# Altium project 8bit_RAM.PrjPcb
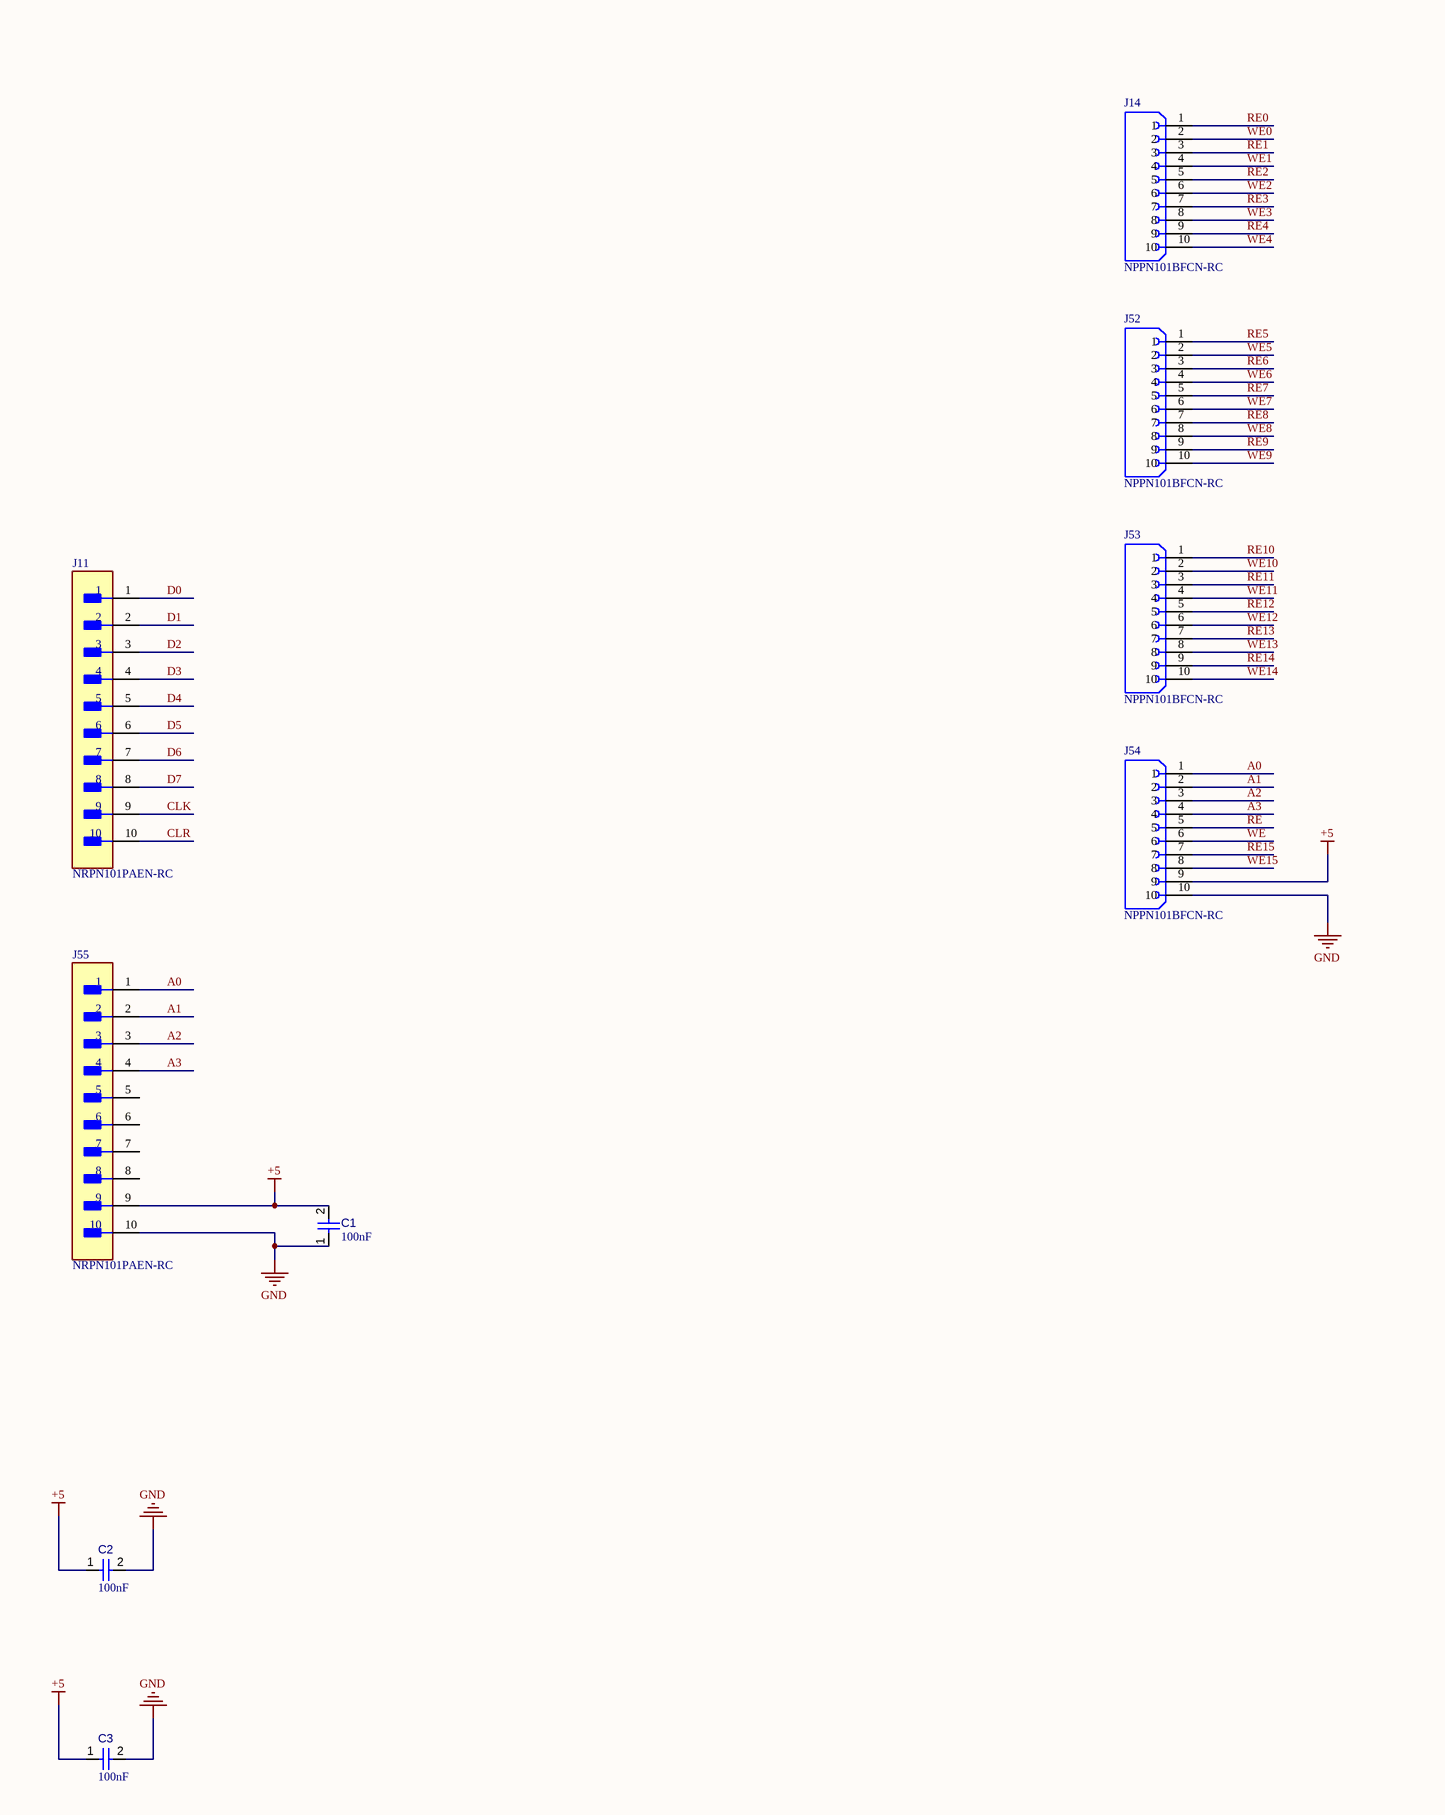
[diagram p0: 8bit_RAM.SchDoc, top left]
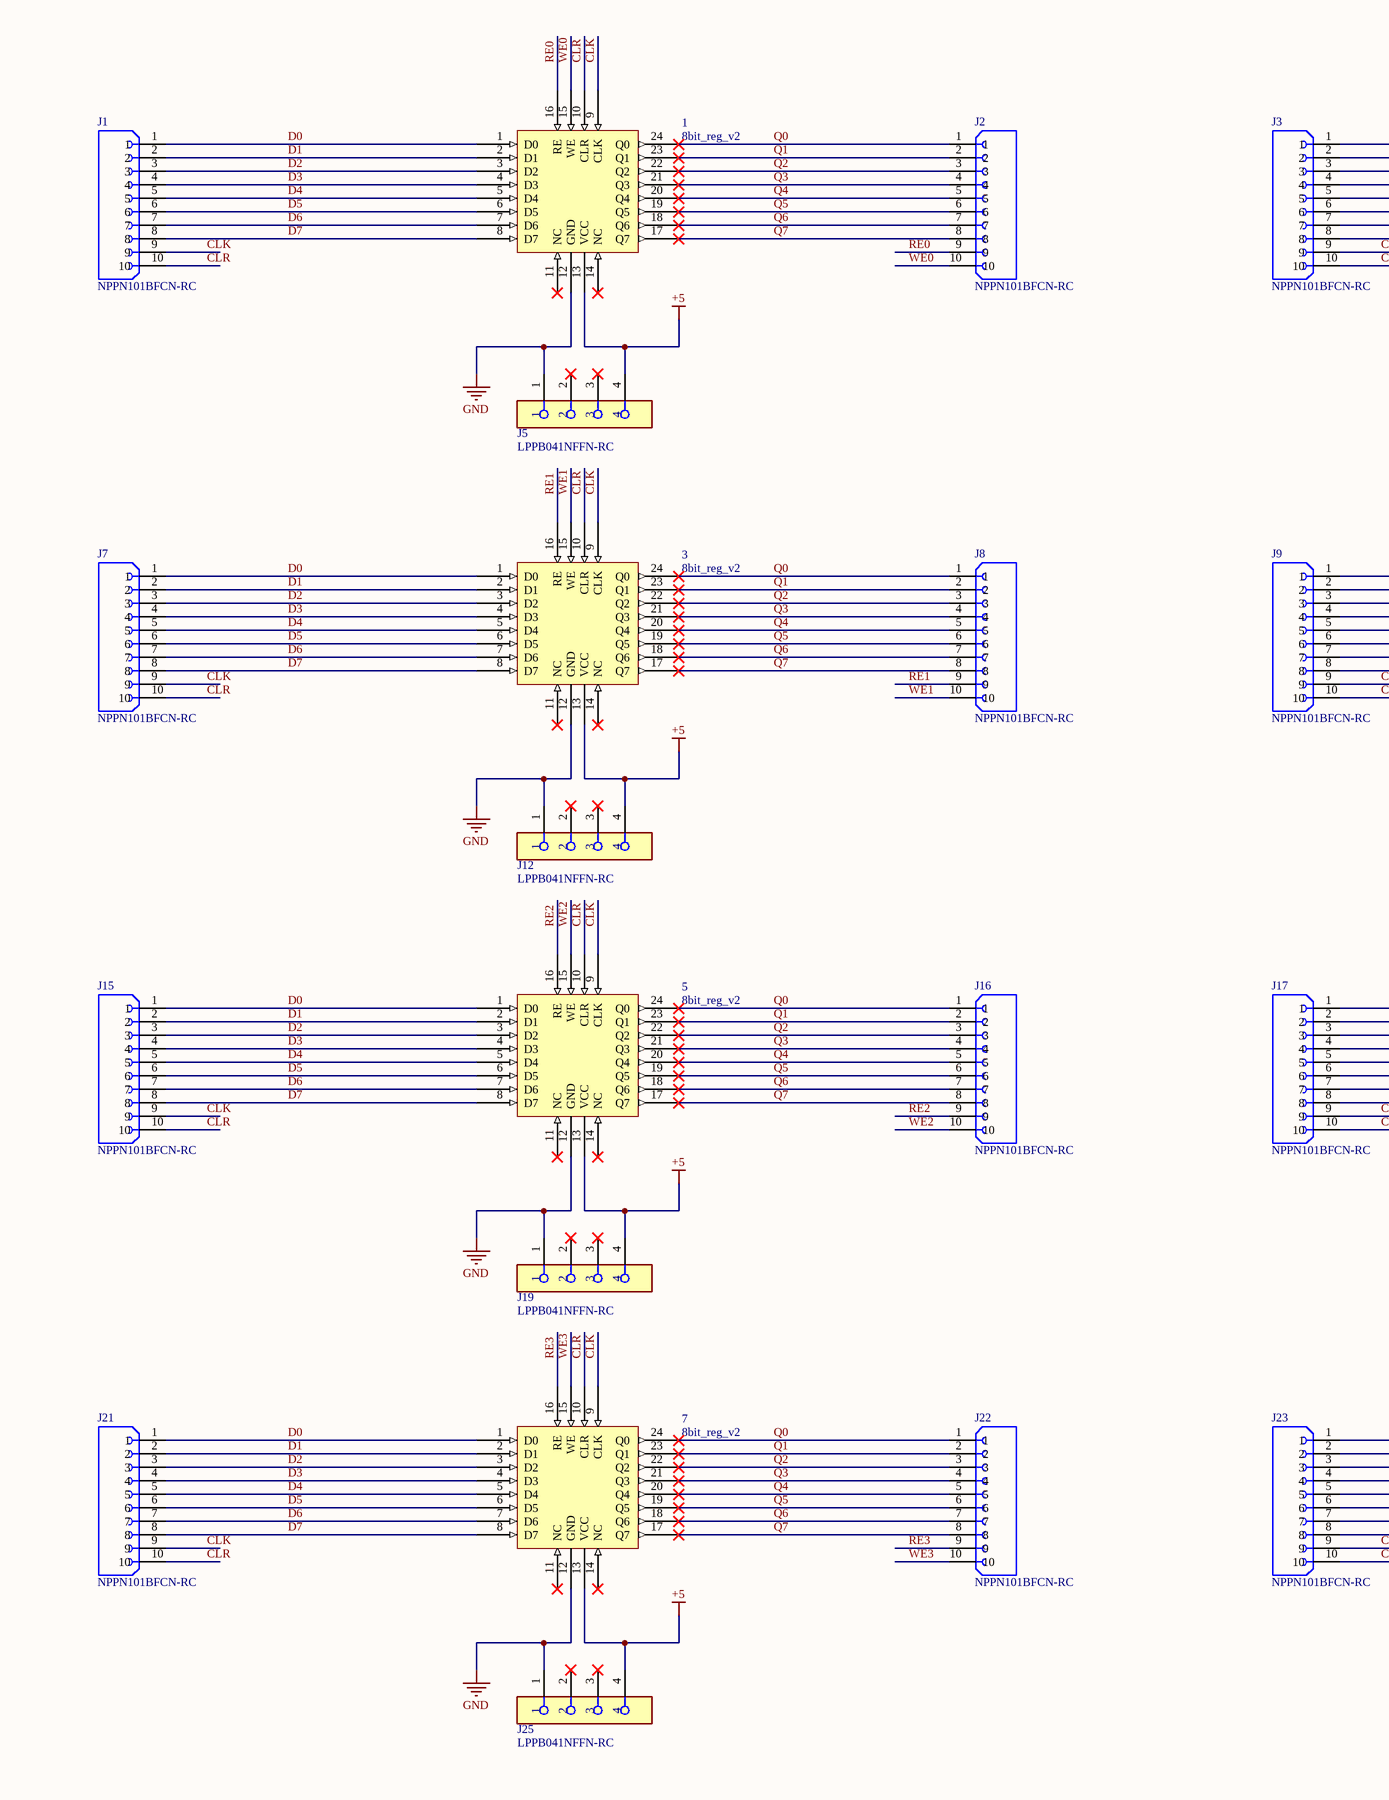
[diagram p1: 8bit_RAM.SchDoc, top middle]
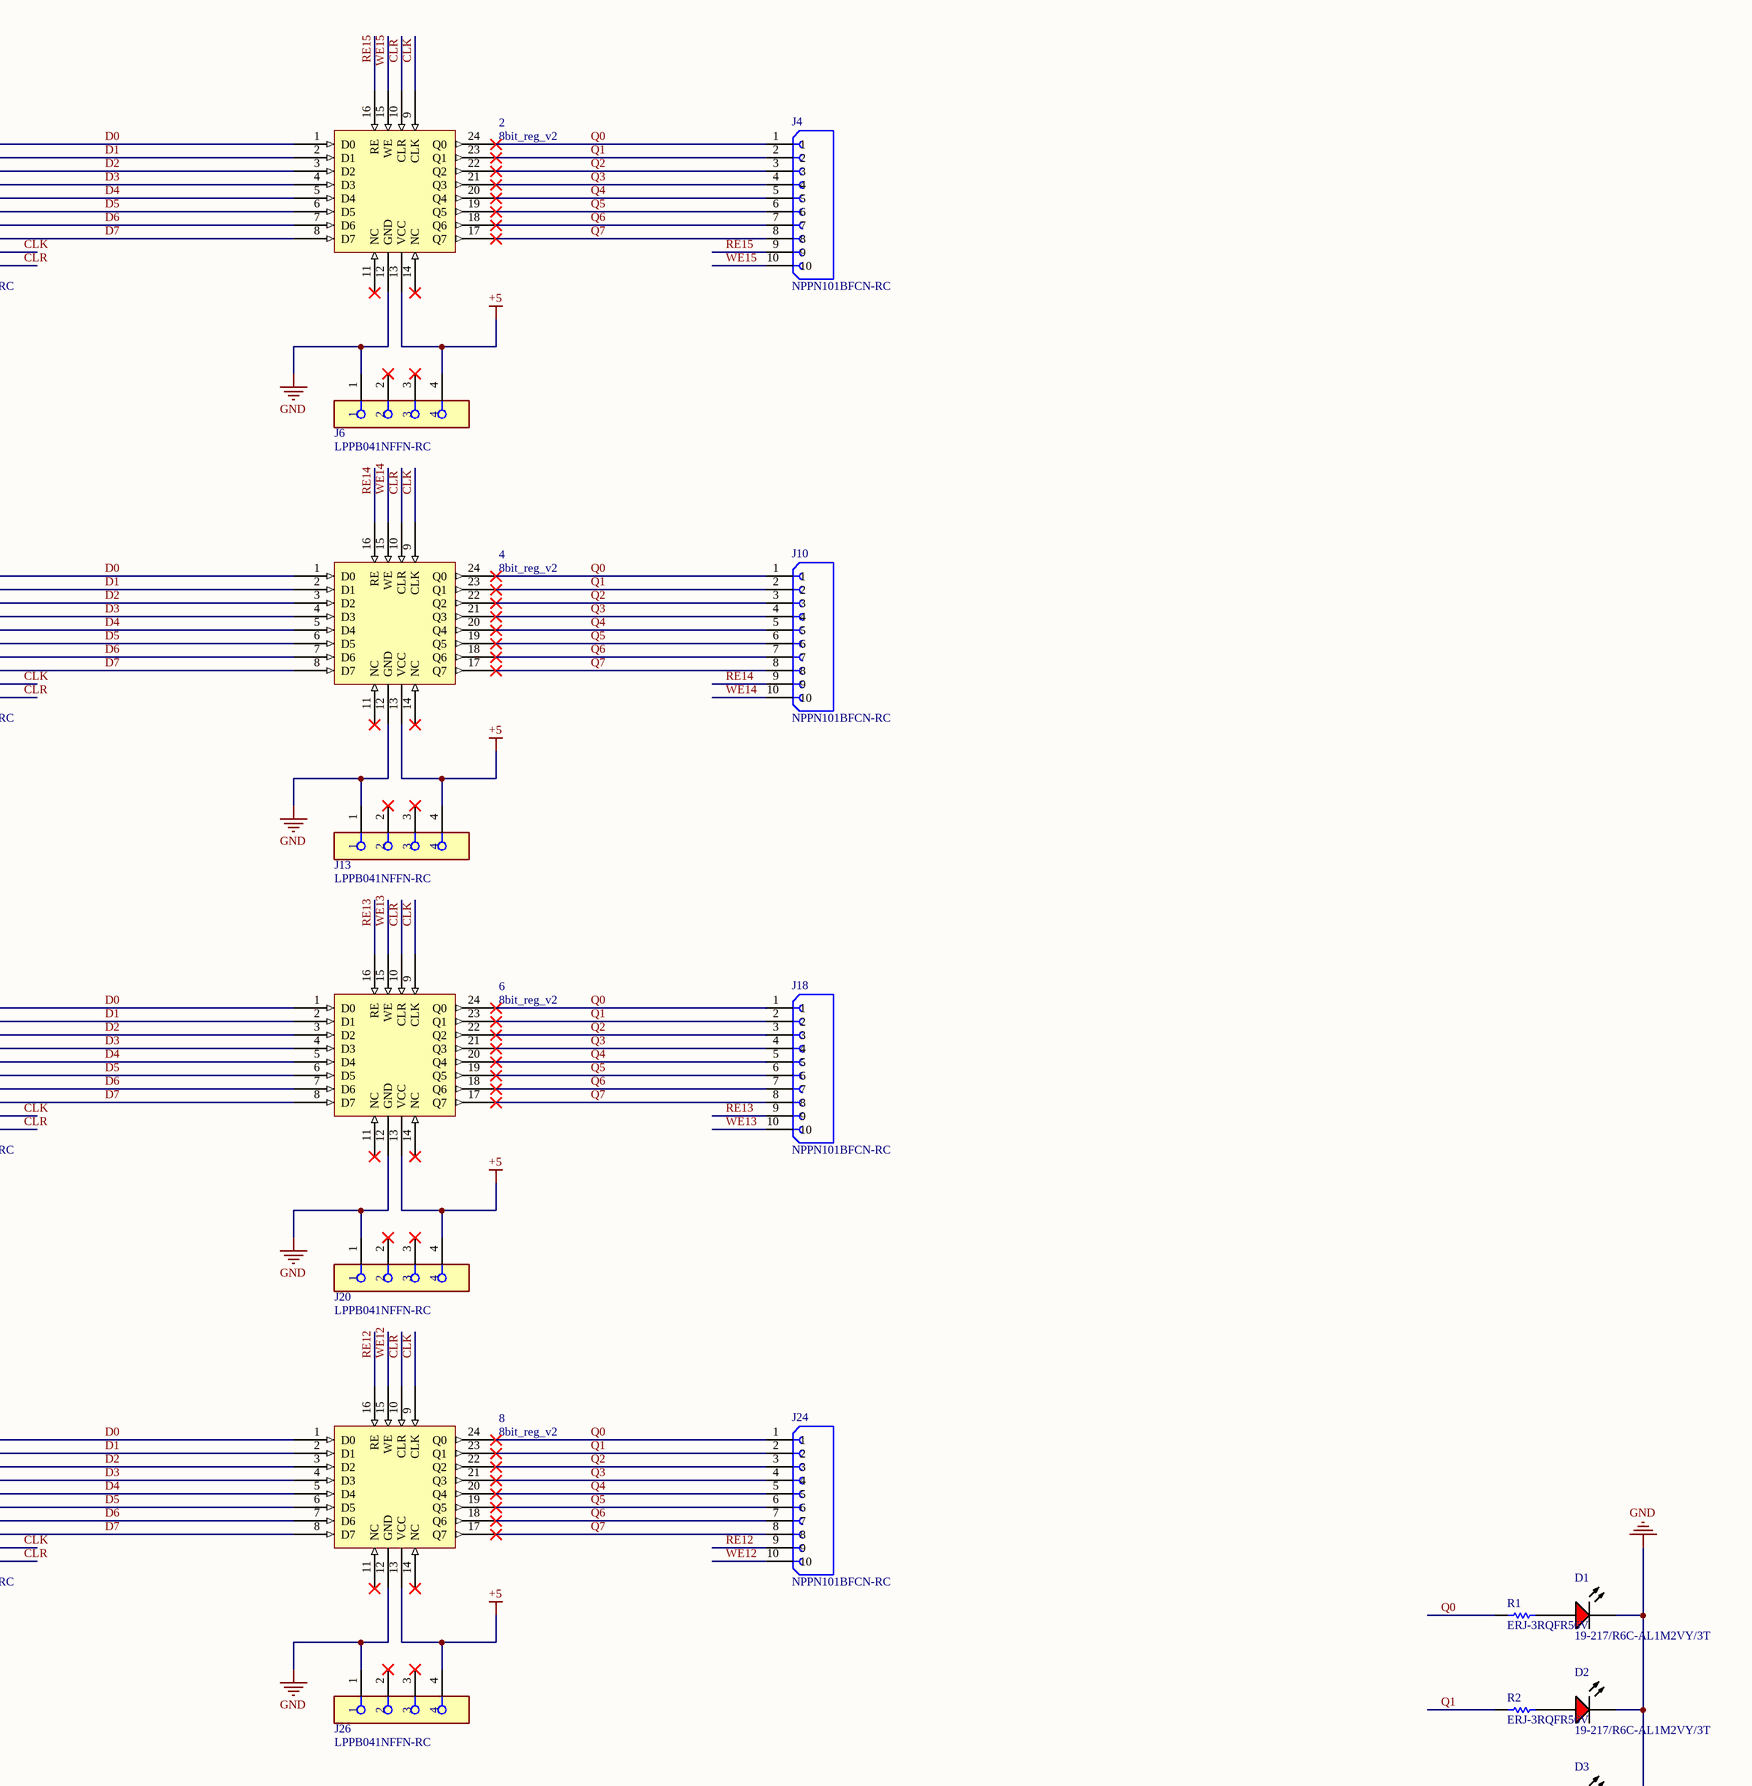
[diagram p2: 8bit_RAM.SchDoc, top right]
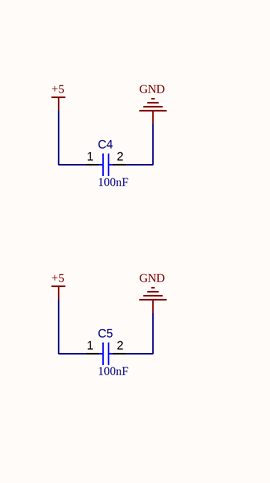
[diagram p3: 8bit_RAM.SchDoc, bottom left]
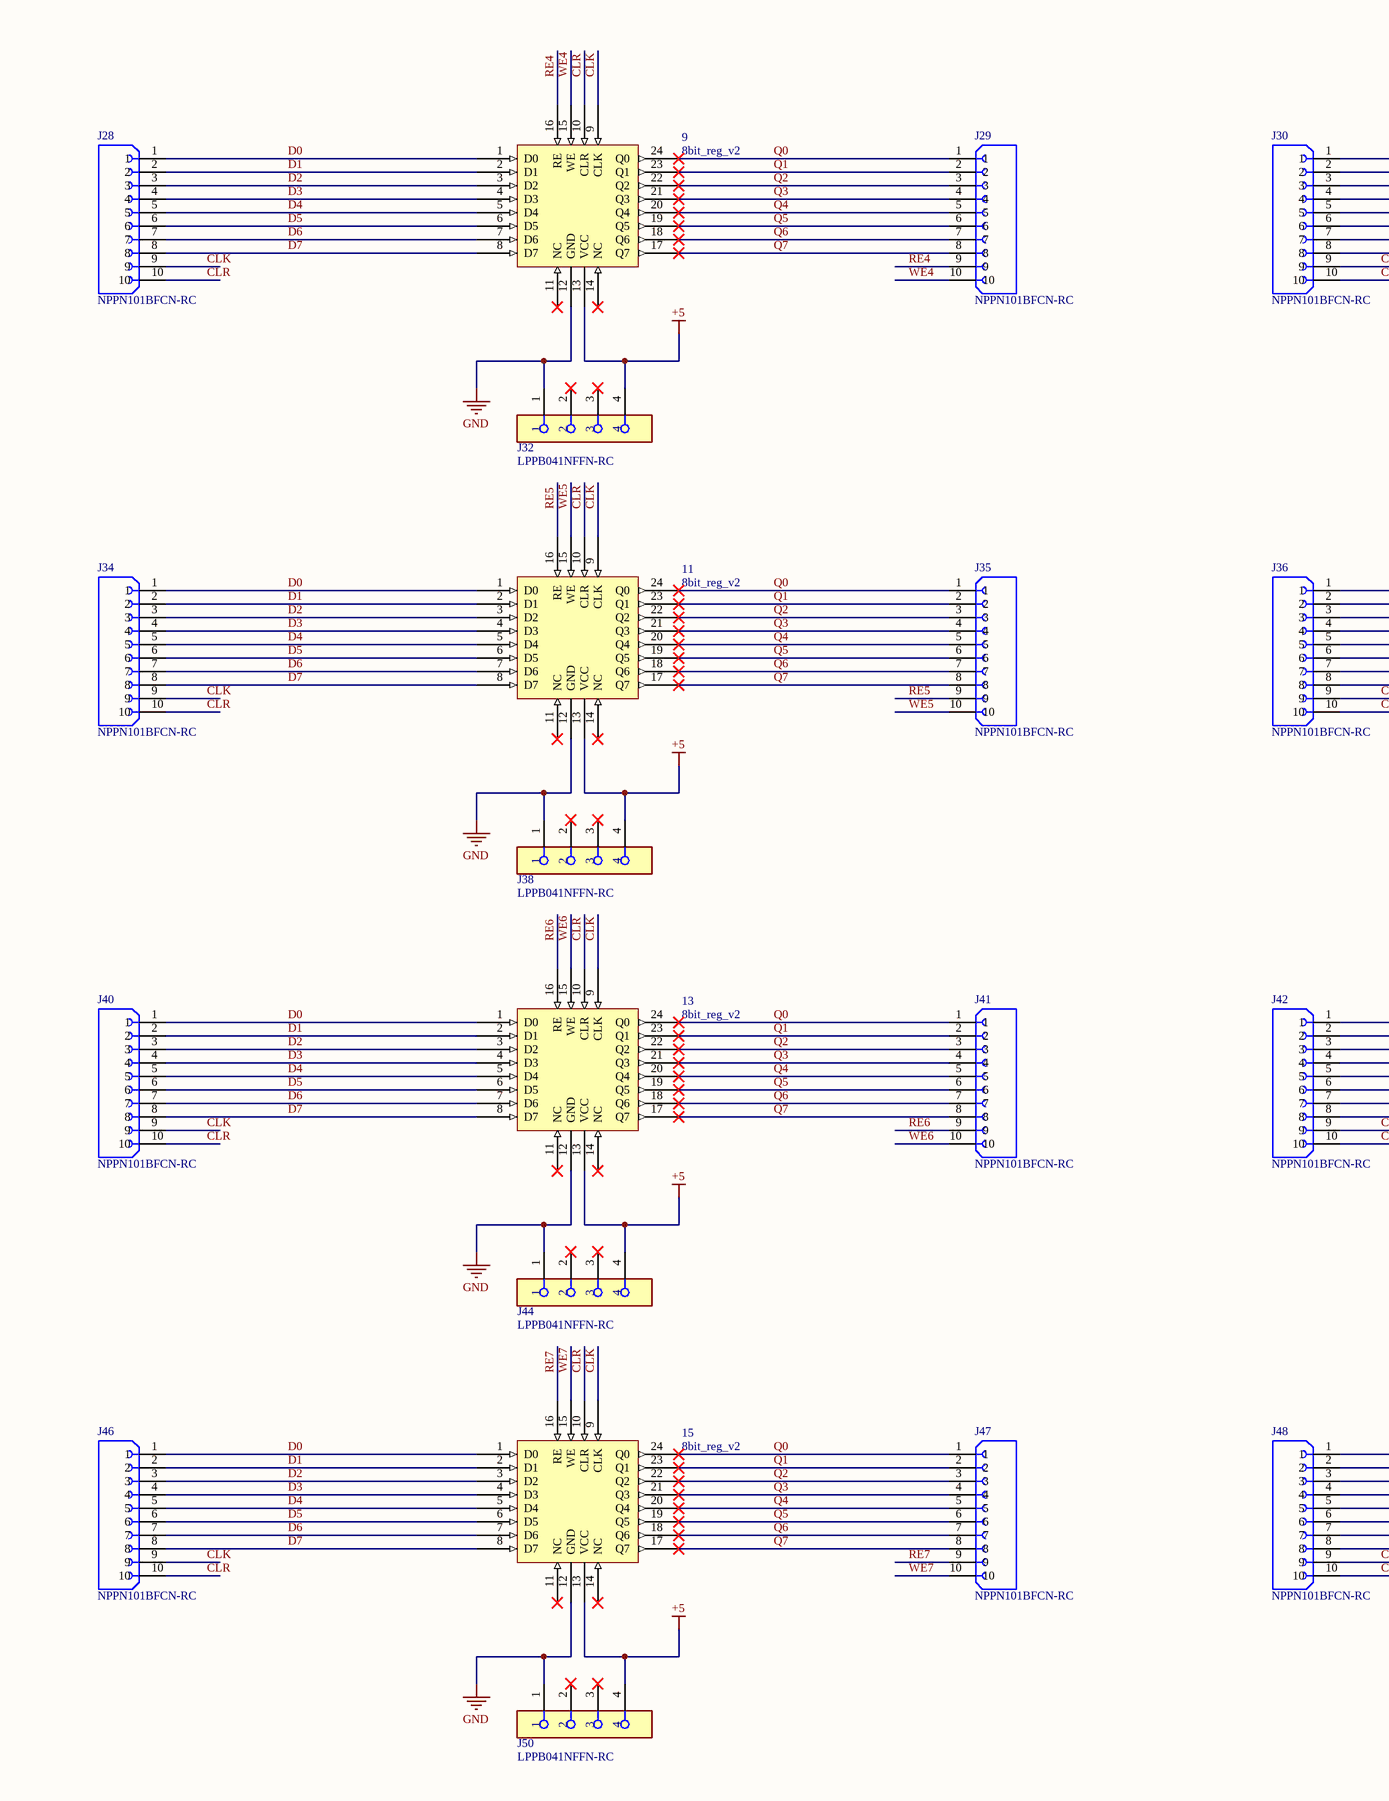
[diagram p4: 8bit_RAM.SchDoc, bottom middle]
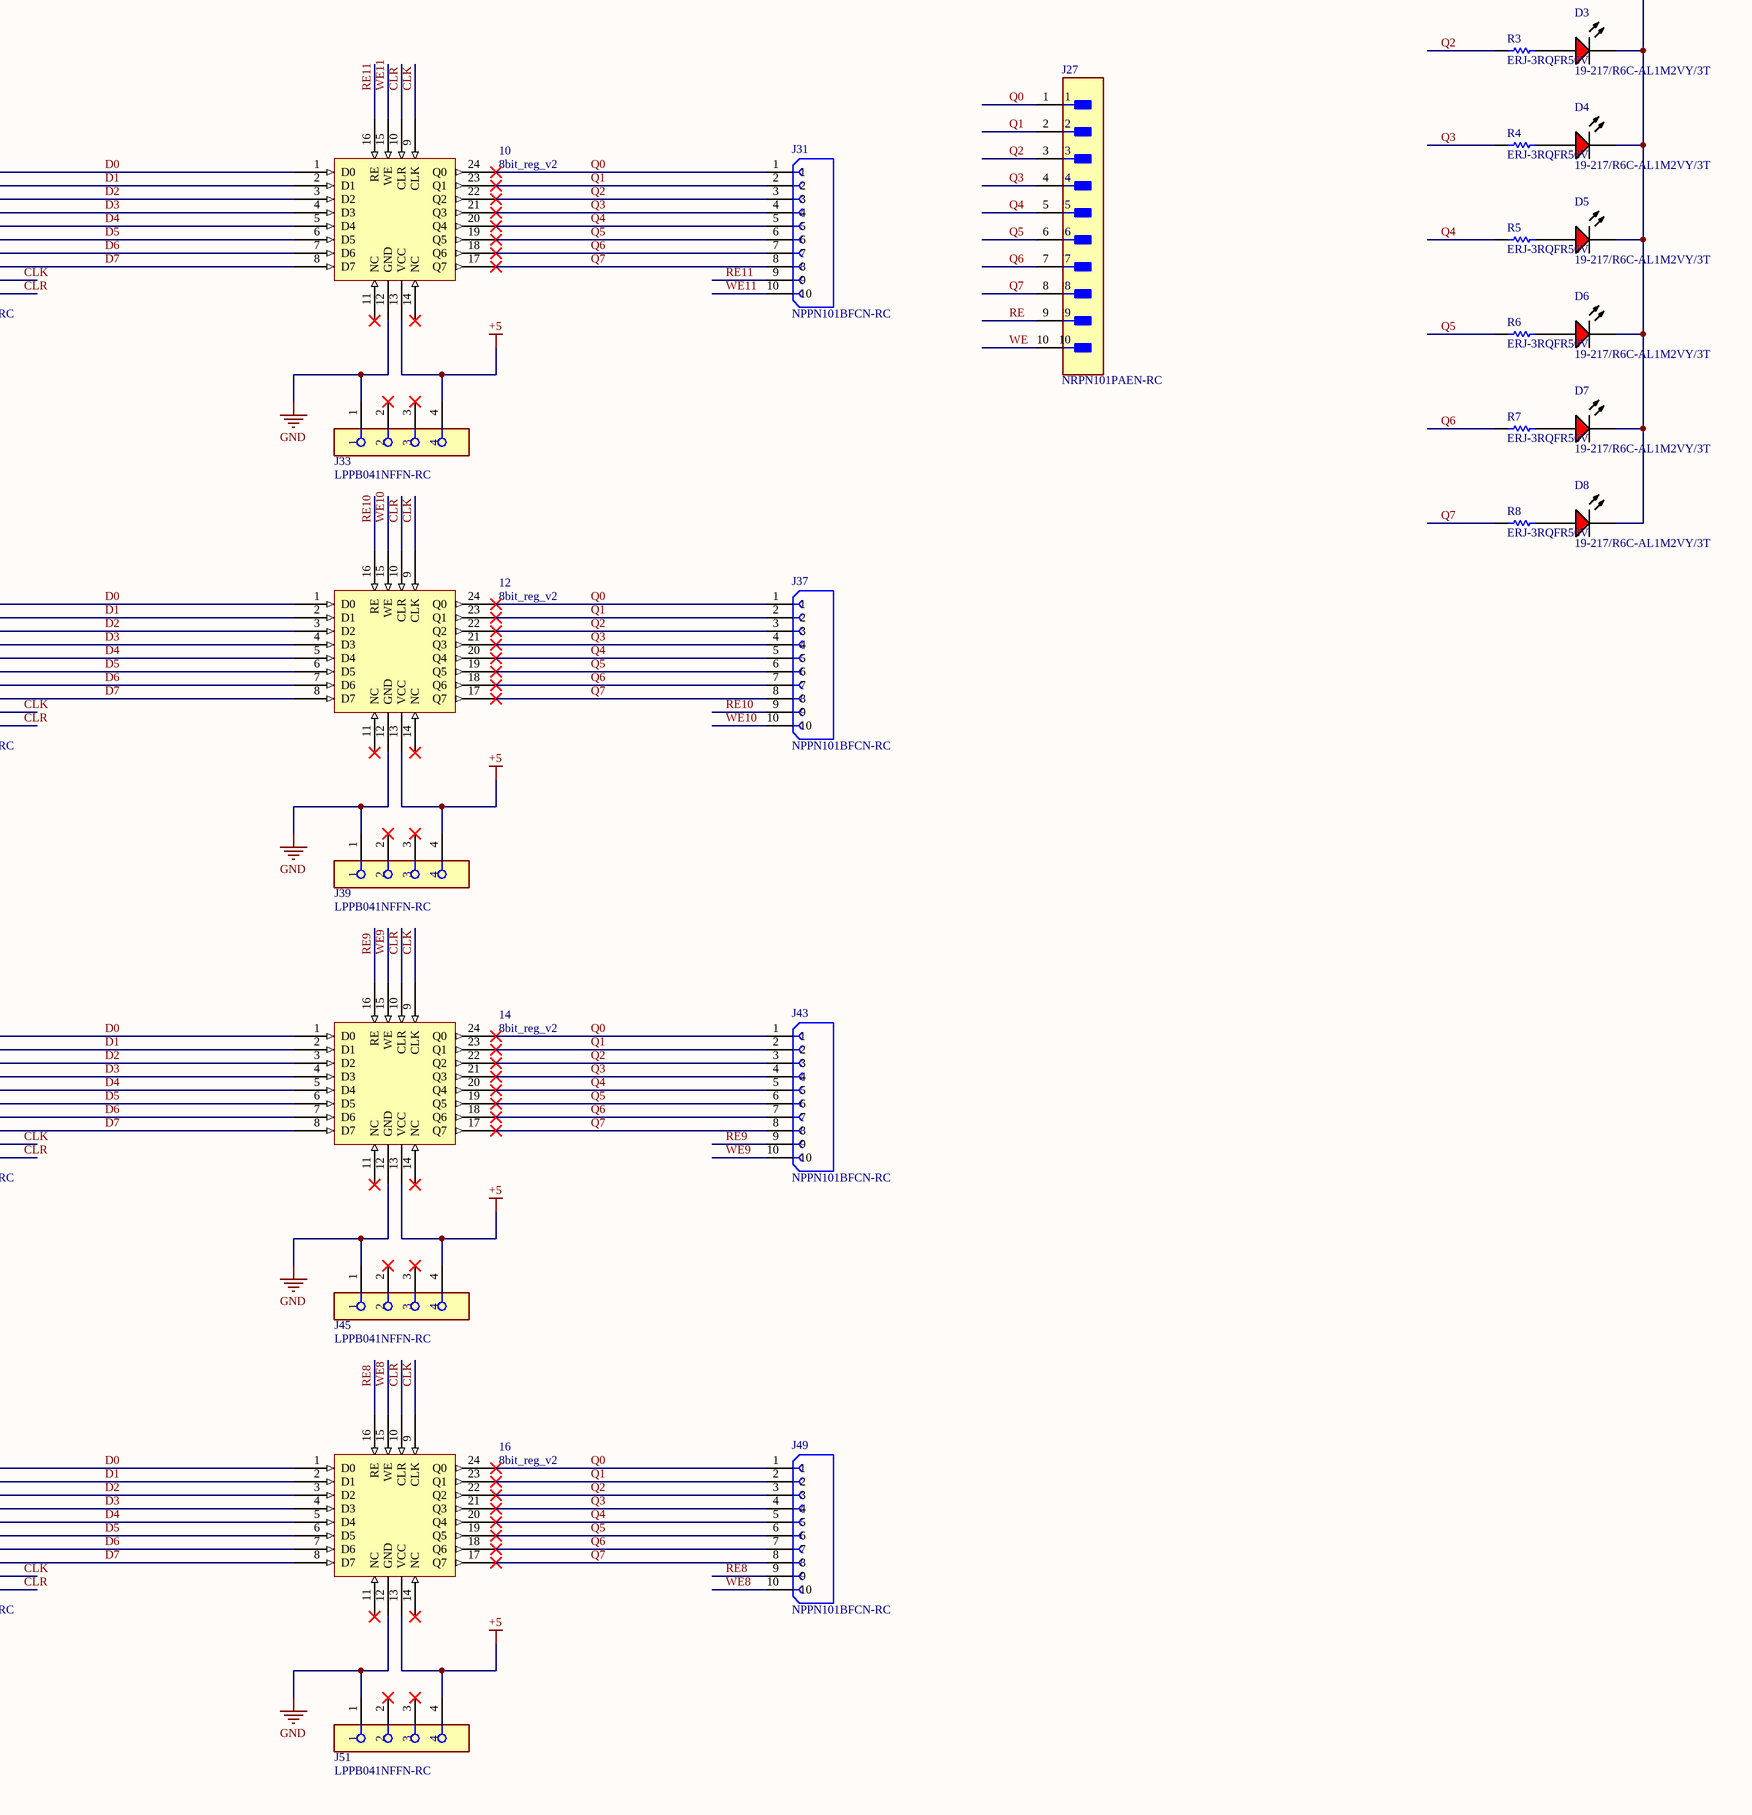
[diagram p5: 8bit_RAM.SchDoc, bottom right]
1 sheet, 92 parts. Net scope: global (net labels, ports and power ports of the same name join across sheets).
Board file: 8bit_RAM.PcbDoc

## Sheet 8bit_RAM.SchDoc
size OrCAD E; SheetNumber: 1; SheetTotal: 1

### Parts
1  8bit_reg_v2
2  8bit_reg_v2
3  8bit_reg_v2
4  8bit_reg_v2
5  8bit_reg_v2
6  8bit_reg_v2
7  8bit_reg_v2
8  8bit_reg_v2
9  8bit_reg_v2
10  8bit_reg_v2
11  8bit_reg_v2
12  8bit_reg_v2
13  8bit_reg_v2
14  8bit_reg_v2
15  8bit_reg_v2
16  8bit_reg_v2
C1  value 100nF  [CAPC1608X90X40NL10T20]  (hidden comment: Capacitor 100 nF +/-10% 50 V 0603)
C2  value 100nF  [CAPC1608X90X40NL10T20]  (hidden comment: Capacitor 100 nF +/-10% 50 V 0603)
C3  value 100nF  [CAPC1608X90X40NL10T20]  (hidden comment: Capacitor 100 nF +/-10% 50 V 0603)
C4  value 100nF  [CAPC1608X90X40NL10T20]  (hidden comment: Capacitor 100 nF +/-10% 50 V 0603)
C5  value 100nF  [CAPC1608X90X40NL10T20]  (hidden comment: Capacitor 100 nF +/-10% 50 V 0603)
D1  19-217/R6C-AL1M2VY/3T  [EVRL-0603-2_V]
D2  19-217/R6C-AL1M2VY/3T  [EVRL-0603-2_V]
D3  19-217/R6C-AL1M2VY/3T  [EVRL-0603-2_V]
D4  19-217/R6C-AL1M2VY/3T  [EVRL-0603-2_V]
D5  19-217/R6C-AL1M2VY/3T  [EVRL-0603-2_V]
D6  19-217/R6C-AL1M2VY/3T  [EVRL-0603-2_V]
D7  19-217/R6C-AL1M2VY/3T  [EVRL-0603-2_V]
D8  19-217/R6C-AL1M2VY/3T  [EVRL-0603-2_V]
J1  NPPN101BFCN-RC  [SULLINS_NPPN101BFCN-RC]
J2  NPPN101BFCN-RC  [SULLINS_NPPN101BFCN-RC]
J3  NPPN101BFCN-RC  [SULLINS_NPPN101BFCN-RC]
J4  NPPN101BFCN-RC  [SULLINS_NPPN101BFCN-RC]
J5  LPPB041NFFN-RC  [FP-LPPB041NFFN-RC-MFG]
J6  LPPB041NFFN-RC  [FP-LPPB041NFFN-RC-MFG]
J7  NPPN101BFCN-RC  [SULLINS_NPPN101BFCN-RC]
J8  NPPN101BFCN-RC  [SULLINS_NPPN101BFCN-RC]
J9  NPPN101BFCN-RC  [SULLINS_NPPN101BFCN-RC]
J10  NPPN101BFCN-RC  [SULLINS_NPPN101BFCN-RC]
J11  NRPN101PAEN-RC  [FP-NRPN101PAEN-RC-MFG]
J12  LPPB041NFFN-RC  [FP-LPPB041NFFN-RC-MFG]
J13  LPPB041NFFN-RC  [FP-LPPB041NFFN-RC-MFG]
J14  NPPN101BFCN-RC  [SULLINS_NPPN101BFCN-RC]
J15  NPPN101BFCN-RC  [SULLINS_NPPN101BFCN-RC]
J16  NPPN101BFCN-RC  [SULLINS_NPPN101BFCN-RC]
J17  NPPN101BFCN-RC  [SULLINS_NPPN101BFCN-RC]
J18  NPPN101BFCN-RC  [SULLINS_NPPN101BFCN-RC]
J19  LPPB041NFFN-RC  [FP-LPPB041NFFN-RC-MFG]
J20  LPPB041NFFN-RC  [FP-LPPB041NFFN-RC-MFG]
J21  NPPN101BFCN-RC  [SULLINS_NPPN101BFCN-RC]
J22  NPPN101BFCN-RC  [SULLINS_NPPN101BFCN-RC]
J23  NPPN101BFCN-RC  [SULLINS_NPPN101BFCN-RC]
J24  NPPN101BFCN-RC  [SULLINS_NPPN101BFCN-RC]
J25  LPPB041NFFN-RC  [FP-LPPB041NFFN-RC-MFG]
J26  LPPB041NFFN-RC  [FP-LPPB041NFFN-RC-MFG]
J27  NRPN101PAEN-RC  [FP-NRPN101PAEN-RC-MFG]
J28  NPPN101BFCN-RC  [SULLINS_NPPN101BFCN-RC]
J29  NPPN101BFCN-RC  [SULLINS_NPPN101BFCN-RC]
J30  NPPN101BFCN-RC  [SULLINS_NPPN101BFCN-RC]
J31  NPPN101BFCN-RC  [SULLINS_NPPN101BFCN-RC]
J32  LPPB041NFFN-RC  [FP-LPPB041NFFN-RC-MFG]
J33  LPPB041NFFN-RC  [FP-LPPB041NFFN-RC-MFG]
J34  NPPN101BFCN-RC  [SULLINS_NPPN101BFCN-RC]
J35  NPPN101BFCN-RC  [SULLINS_NPPN101BFCN-RC]
J36  NPPN101BFCN-RC  [SULLINS_NPPN101BFCN-RC]
J37  NPPN101BFCN-RC  [SULLINS_NPPN101BFCN-RC]
J38  LPPB041NFFN-RC  [FP-LPPB041NFFN-RC-MFG]
J39  LPPB041NFFN-RC  [FP-LPPB041NFFN-RC-MFG]
J40  NPPN101BFCN-RC  [SULLINS_NPPN101BFCN-RC]
J41  NPPN101BFCN-RC  [SULLINS_NPPN101BFCN-RC]
J42  NPPN101BFCN-RC  [SULLINS_NPPN101BFCN-RC]
J43  NPPN101BFCN-RC  [SULLINS_NPPN101BFCN-RC]
J44  LPPB041NFFN-RC  [FP-LPPB041NFFN-RC-MFG]
J45  LPPB041NFFN-RC  [FP-LPPB041NFFN-RC-MFG]
J46  NPPN101BFCN-RC  [SULLINS_NPPN101BFCN-RC]
J47  NPPN101BFCN-RC  [SULLINS_NPPN101BFCN-RC]
J48  NPPN101BFCN-RC  [SULLINS_NPPN101BFCN-RC]
J49  NPPN101BFCN-RC  [SULLINS_NPPN101BFCN-RC]
J50  LPPB041NFFN-RC  [FP-LPPB041NFFN-RC-MFG]
J51  LPPB041NFFN-RC  [FP-LPPB041NFFN-RC-MFG]
J52  NPPN101BFCN-RC  [SULLINS_NPPN101BFCN-RC]
J53  NPPN101BFCN-RC  [SULLINS_NPPN101BFCN-RC]
J54  NPPN101BFCN-RC  [SULLINS_NPPN101BFCN-RC]
J55  NRPN101PAEN-RC  [FP-NRPN101PAEN-RC-MFG]
R1  ERJ-3RQFR56V  [RESC1608X55X30NL15T15]
R2  ERJ-3RQFR56V  [RESC1608X55X30NL15T15]
R3  ERJ-3RQFR56V  [RESC1608X55X30NL15T15]
R4  ERJ-3RQFR56V  [RESC1608X55X30NL15T15]
R5  ERJ-3RQFR56V  [RESC1608X55X30NL15T15]
R6  ERJ-3RQFR56V  [RESC1608X55X30NL15T15]
R7  ERJ-3RQFR56V  [RESC1608X55X30NL15T15]
R8  ERJ-3RQFR56V  [RESC1608X55X30NL15T15]

### Nets
+5: 1.13(VCC) 2.13(VCC) 3.13(VCC) 4.13(VCC) 5.13(VCC) 6.13(VCC) 7.13(VCC) 8.13(VCC) 9.13(VCC) 10.13(VCC) 11.13(VCC) 12.13(VCC) 13.13(VCC) 14.13(VCC) 15.13(VCC) 16.13(VCC) C1.2 C2.1 C3.1 C4.1 C5.1 J5.4 J6.4 J12.4 J13.4 J19.4 J20.4 J25.4 J26.4 J32.4 J33.4 J38.4 J39.4 J44.4 J45.4 J50.4 J51.4 J54.9 J55.9
GND: 1.12(GND) 2.12(GND) 3.12(GND) 4.12(GND) 5.12(GND) 6.12(GND) 7.12(GND) 8.12(GND) 9.12(GND) 10.12(GND) 11.12(GND) 12.12(GND) 13.12(GND) 14.12(GND) 15.12(GND) 16.12(GND) C1.1 C2.2 C3.2 C4.2 C5.2 D1.2(K) D2.2(K) D3.2(K) D4.2(K) D5.2(K) D6.2(K) D7.2(K) D8.2(K) J5.1 J6.1 J12.1 J13.1 J19.1 J20.1 J25.1 J26.1 J32.1 J33.1 J38.1 J39.1 J44.1 J45.1 J50.1 J51.1 J54.10 J55.10
A0: J54.1 J55.1
A1: J54.2 J55.2
A2: J54.3 J55.3
A3: J54.4 J55.4
CLK: 1.9(CLK) 2.9(CLK) 3.9(CLK) 4.9(CLK) 5.9(CLK) 6.9(CLK) 7.9(CLK) 8.9(CLK) 9.9(CLK) 10.9(CLK) 11.9(CLK) 12.9(CLK) 13.9(CLK) 14.9(CLK) 15.9(CLK) 16.9(CLK) J1.9 J3.9 J7.9 J9.9 J11.9 J15.9 J17.9 J21.9 J23.9 J28.9 J30.9 J34.9 J36.9 J40.9 J42.9 J46.9 J48.9
CLR: 1.10(CLR) 2.10(CLR) 3.10(CLR) 4.10(CLR) 5.10(CLR) 6.10(CLR) 7.10(CLR) 8.10(CLR) 9.10(CLR) 10.10(CLR) 11.10(CLR) 12.10(CLR) 13.10(CLR) 14.10(CLR) 15.10(CLR) 16.10(CLR) J1.10 J3.10 J7.10 J9.10 J11.10 J15.10 J17.10 J21.10 J23.10 J28.10 J30.10 J34.10 J36.10 J40.10 J42.10 J46.10 J48.10
D0: 1.1(D0) 2.1(D0) 3.1(D0) 4.1(D0) 5.1(D0) 6.1(D0) 7.1(D0) 8.1(D0) 9.1(D0) 10.1(D0) 11.1(D0) 12.1(D0) 13.1(D0) 14.1(D0) 15.1(D0) 16.1(D0) J1.1 J3.1 J7.1 J9.1 J11.1 J15.1 J17.1 J21.1 J23.1 J28.1 J30.1 J34.1 J36.1 J40.1 J42.1 J46.1 J48.1
D1: 1.2(D1) 2.2(D1) 3.2(D1) 4.2(D1) 5.2(D1) 6.2(D1) 7.2(D1) 8.2(D1) 9.2(D1) 10.2(D1) 11.2(D1) 12.2(D1) 13.2(D1) 14.2(D1) 15.2(D1) 16.2(D1) J1.2 J3.2 J7.2 J9.2 J11.2 J15.2 J17.2 J21.2 J23.2 J28.2 J30.2 J34.2 J36.2 J40.2 J42.2 J46.2 J48.2
D2: 1.3(D2) 2.3(D2) 3.3(D2) 4.3(D2) 5.3(D2) 6.3(D2) 7.3(D2) 8.3(D2) 9.3(D2) 10.3(D2) 11.3(D2) 12.3(D2) 13.3(D2) 14.3(D2) 15.3(D2) 16.3(D2) J1.3 J3.3 J7.3 J9.3 J11.3 J15.3 J17.3 J21.3 J23.3 J28.3 J30.3 J34.3 J36.3 J40.3 J42.3 J46.3 J48.3
D3: 1.4(D3) 2.4(D3) 3.4(D3) 4.4(D3) 5.4(D3) 6.4(D3) 7.4(D3) 8.4(D3) 9.4(D3) 10.4(D3) 11.4(D3) 12.4(D3) 13.4(D3) 14.4(D3) 15.4(D3) 16.4(D3) J1.4 J3.4 J7.4 J9.4 J11.4 J15.4 J17.4 J21.4 J23.4 J28.4 J30.4 J34.4 J36.4 J40.4 J42.4 J46.4 J48.4
D4: 1.5(D4) 2.5(D4) 3.5(D4) 4.5(D4) 5.5(D4) 6.5(D4) 7.5(D4) 8.5(D4) 9.5(D4) 10.5(D4) 11.5(D4) 12.5(D4) 13.5(D4) 14.5(D4) 15.5(D4) 16.5(D4) J1.5 J3.5 J7.5 J9.5 J11.5 J15.5 J17.5 J21.5 J23.5 J28.5 J30.5 J34.5 J36.5 J40.5 J42.5 J46.5 J48.5
D5: 1.6(D5) 2.6(D5) 3.6(D5) 4.6(D5) 5.6(D5) 6.6(D5) 7.6(D5) 8.6(D5) 9.6(D5) 10.6(D5) 11.6(D5) 12.6(D5) 13.6(D5) 14.6(D5) 15.6(D5) 16.6(D5) J1.6 J3.6 J7.6 J9.6 J11.6 J15.6 J17.6 J21.6 J23.6 J28.6 J30.6 J34.6 J36.6 J40.6 J42.6 J46.6 J48.6
D6: 1.7(D6) 2.7(D6) 3.7(D6) 4.7(D6) 5.7(D6) 6.7(D6) 7.7(D6) 8.7(D6) 9.7(D6) 10.7(D6) 11.7(D6) 12.7(D6) 13.7(D6) 14.7(D6) 15.7(D6) 16.7(D6) J1.7 J3.7 J7.7 J9.7 J11.7 J15.7 J17.7 J21.7 J23.7 J28.7 J30.7 J34.7 J36.7 J40.7 J42.7 J46.7 J48.7
D7: 1.8(D7) 2.8(D7) 3.8(D7) 4.8(D7) 5.8(D7) 6.8(D7) 7.8(D7) 8.8(D7) 9.8(D7) 10.8(D7) 11.8(D7) 12.8(D7) 13.8(D7) 14.8(D7) 15.8(D7) 16.8(D7) J1.8 J3.8 J7.8 J9.8 J11.8 J15.8 J17.8 J21.8 J23.8 J28.8 J30.8 J34.8 J36.8 J40.8 J42.8 J46.8 J48.8
Q0: 1.24(Q0) 2.24(Q0) 3.24(Q0) 4.24(Q0) 5.24(Q0) 6.24(Q0) 7.24(Q0) 8.24(Q0) 9.24(Q0) 10.24(Q0) 11.24(Q0) 12.24(Q0) 13.24(Q0) 14.24(Q0) 15.24(Q0) 16.24(Q0) J2.1 J4.1 J8.1 J10.1 J16.1 J18.1 J22.1 J24.1 J27.1 J29.1 J31.1 J35.1 J37.1 J41.1 J43.1 J47.1 J49.1 R1.1
Q1: 1.23(Q1) 2.23(Q1) 3.23(Q1) 4.23(Q1) 5.23(Q1) 6.23(Q1) 7.23(Q1) 8.23(Q1) 9.23(Q1) 10.23(Q1) 11.23(Q1) 12.23(Q1) 13.23(Q1) 14.23(Q1) 15.23(Q1) 16.23(Q1) J2.2 J4.2 J8.2 J10.2 J16.2 J18.2 J22.2 J24.2 J27.2 J29.2 J31.2 J35.2 J37.2 J41.2 J43.2 J47.2 J49.2 R2.1
Q2: 1.22(Q2) 2.22(Q2) 3.22(Q2) 4.22(Q2) 5.22(Q2) 6.22(Q2) 7.22(Q2) 8.22(Q2) 9.22(Q2) 10.22(Q2) 11.22(Q2) 12.22(Q2) 13.22(Q2) 14.22(Q2) 15.22(Q2) 16.22(Q2) J2.3 J4.3 J8.3 J10.3 J16.3 J18.3 J22.3 J24.3 J27.3 J29.3 J31.3 J35.3 J37.3 J41.3 J43.3 J47.3 J49.3 R3.1
Q3: 1.21(Q3) 2.21(Q3) 3.21(Q3) 4.21(Q3) 5.21(Q3) 6.21(Q3) 7.21(Q3) 8.21(Q3) 9.21(Q3) 10.21(Q3) 11.21(Q3) 12.21(Q3) 13.21(Q3) 14.21(Q3) 15.21(Q3) 16.21(Q3) J2.4 J4.4 J8.4 J10.4 J16.4 J18.4 J22.4 J24.4 J27.4 J29.4 J31.4 J35.4 J37.4 J41.4 J43.4 J47.4 J49.4 R4.1
Q4: 1.20(Q4) 2.20(Q4) 3.20(Q4) 4.20(Q4) 5.20(Q4) 6.20(Q4) 7.20(Q4) 8.20(Q4) 9.20(Q4) 10.20(Q4) 11.20(Q4) 12.20(Q4) 13.20(Q4) 14.20(Q4) 15.20(Q4) 16.20(Q4) J2.5 J4.5 J8.5 J10.5 J16.5 J18.5 J22.5 J24.5 J27.5 J29.5 J31.5 J35.5 J37.5 J41.5 J43.5 J47.5 J49.5 R5.1
Q5: 1.19(Q5) 2.19(Q5) 3.19(Q5) 4.19(Q5) 5.19(Q5) 6.19(Q5) 7.19(Q5) 8.19(Q5) 9.19(Q5) 10.19(Q5) 11.19(Q5) 12.19(Q5) 13.19(Q5) 14.19(Q5) 15.19(Q5) 16.19(Q5) J2.6 J4.6 J8.6 J10.6 J16.6 J18.6 J22.6 J24.6 J27.6 J29.6 J31.6 J35.6 J37.6 J41.6 J43.6 J47.6 J49.6 R6.1
Q6: 1.18(Q6) 2.18(Q6) 3.18(Q6) 4.18(Q6) 5.18(Q6) 6.18(Q6) 7.18(Q6) 8.18(Q6) 9.18(Q6) 10.18(Q6) 11.18(Q6) 12.18(Q6) 13.18(Q6) 14.18(Q6) 15.18(Q6) 16.18(Q6) J2.7 J4.7 J8.7 J10.7 J16.7 J18.7 J22.7 J24.7 J27.7 J29.7 J31.7 J35.7 J37.7 J41.7 J43.7 J47.7 J49.7 R7.1
Q7: 1.17(Q7) 2.17(Q7) 3.17(Q7) 4.17(Q7) 5.17(Q7) 6.17(Q7) 7.17(Q7) 8.17(Q7) 9.17(Q7) 10.17(Q7) 11.17(Q7) 12.17(Q7) 13.17(Q7) 14.17(Q7) 15.17(Q7) 16.17(Q7) J2.8 J4.8 J8.8 J10.8 J16.8 J18.8 J22.8 J24.8 J27.8 J29.8 J31.8 J35.8 J37.8 J41.8 J43.8 J47.8 J49.8 R8.1
RE: J27.9 J54.5
RE0: 1.16(RE) J2.9 J14.1
RE1: 3.16(RE) J8.9 J14.3
RE2: 5.16(RE) J14.5 J16.9
RE3: 7.16(RE) J14.7 J22.9
RE4: 9.16(RE) J14.9 J29.9
RE5: 11.16(RE) J35.9 J52.1
RE6: 13.16(RE) J41.9 J52.3
RE7: 15.16(RE) J47.9 J52.5
RE8: 16.16(RE) J49.9 J52.7
RE9: 14.16(RE) J43.9 J52.9
RE10: 12.16(RE) J37.9 J53.1
RE11: 10.16(RE) J31.9 J53.3
RE12: 8.16(RE) J24.9 J53.5
RE13: 6.16(RE) J18.9 J53.7
RE14: 4.16(RE) J10.9 J53.9
RE15: 2.16(RE) J4.9 J54.7
WE: J27.10 J54.6
WE0: 1.15(WE) J2.10 J14.2
WE1: 3.15(WE) J8.10 J14.4
WE2: 5.15(WE) J14.6 J16.10
WE3: 7.15(WE) J14.8 J22.10
WE4: 9.15(WE) J14.10 J29.10
WE5: 11.15(WE) J35.10 J52.2
WE6: 13.15(WE) J41.10 J52.4
WE7: 15.15(WE) J47.10 J52.6
WE8: 16.15(WE) J49.10 J52.8
WE9: 14.15(WE) J43.10 J52.10
WE10: 12.15(WE) J37.10 J53.2
WE11: 10.15(WE) J31.10 J53.4
WE12: 8.15(WE) J24.10 J53.6
WE13: 6.15(WE) J18.10 J53.8
WE14: 4.15(WE) J10.10 J53.10
WE15: 2.15(WE) J4.10 J54.8
NetD1_1: D1.1(A) R1.2
NetD2_1: D2.1(A) R2.2
NetD3_1: D3.1(A) R3.2
NetD4_1: D4.1(A) R4.2
NetD5_1: D5.1(A) R5.2
NetD6_1: D6.1(A) R6.2
NetD7_1: D7.1(A) R7.2
NetD8_1: D8.1(A) R8.2

Not connected (* = marked no-connect by the designer): 1 11(NC)* 14(NC)*; 2 11(NC)* 14(NC)*; 3 11(NC)* 14(NC)*; 4 11(NC)* 14(NC)*; 5 11(NC)* 14(NC)*; 6 11(NC)* 14(NC)*; 7 11(NC)* 14(NC)*; 8 11(NC)* 14(NC)*; 9 11(NC)* 14(NC)*; 10 11(NC)* 14(NC)*; 11 11(NC)* 14(NC)*; 12 11(NC)* 14(NC)*; 13 11(NC)* 14(NC)*; 14 11(NC)* 14(NC)*; 15 11(NC)* 14(NC)*; 16 11(NC)* 14(NC)*; J5 2* 3*; J6 2* 3*; J12 2* 3*; J13 2* 3*; J19 2* 3*; J20 2* 3*; J25 2* 3*; J26 2* 3*; J32 2* 3*; J33 2* 3*; J38 2* 3*; J39 2* 3*; J44 2* 3*; J45 2* 3*; J50 2* 3*; J51 2* 3*; J55 5 6 7 8

### Library data of the parts
1-16 = CMP-019-00051-3
C1-C5 = CMP-001-00017-6: Chip Capacitor, 100 nF, +/- 10%, 50 V, 0603 (1608 Metric); Voltage Rating: 50V; Capacitor Type: Ceramic; Tolerance: 10%; Mounting Technology: SM; Max Operating Temperature: 125°C; RoHS Compliant: True; Pins: 2; Case/Package: 0603; Min Operating Temperature: -55°C
D1-D8 = CMP-007-00004-2: Chip LED, Red, 5 V, 25 mA, -40 to 85 degC, 2-Pin SMD (0603), RoHS, Tape and Reel; Manufacturer: Everlight Electronics; Forward Voltage: 2.2V; Lens Style: Clear; Package Reference: 0603; Datasheet Version: Rev. 1, 01/2005; Mounting Technology: SM; RoHS Compliant: False; Datasheet URL: https://datasheet.ciiva.com/4688/el-19-217-r6c-al1m2vy-3tpdf-187026-4688713.pdf; Case/Package: 0603; Colour: Red; Manufacturer URL: http://www.everlight.com/; Package Description: 2-Pin Surface Mount Device, Body 1.6 x 0.8 mm
J1-J4 J7-J10 J14-J18 J21-J24 J28-J31 J34-J37 J40-J43 J46-J49 J52-J54 = CMP-003-000000-1: 10 Position Header Connector 0.079 (2.00mm) Through Hole Gold; MF: Sullins Connector; Source: NPPN101BFCN-RC.SchLib; Check_prices: https://www.snapeda.com/parts/NPPN101BFCN-RC/Sullins/view-part/?ref=eda; MP: NPPN101BFCN-RC; Component Type: Standard; SnapEDA_Link: https://www.snapeda.com/parts/NPPN101BFCN-RC/Sullins/view-part/?ref=snap; Package: None; Value: *; Pin Count: 10; Design Item ID: NPPN101BFCN-RC
J5 J6 J12 J13 J19 J20 J25 J26 J32 J33 J38 J39 J44 J45 J50 J51 = CMP-25680-000035-1: CONN HDR 4POS 0.05 GOLD PCB; Pitch: 0.05inch; Number of Positions: 4; Connector Type: Header; Contact Type: Female Socket; Lead Free: Lead Free; Mount: Through Hole; RoHS Compliant: Yes; Package Quantity: 1; Termination: Solder; Contact Plating: Gold; Number of Rows: 1; Packaging: Bulk
J11 J27 J55 = CMP-25680-000006-1: CONN HEADER VERT 10POS 2MM; Manufacturer: Sullins; Current Rating: 2A; Conn Gender: Male; Voltage Rating: 150V; Conn Orientation: Straight; Number Of Contacts: 10; Temperature: -40°C to +105°C; Manufacturer Part Number: NRPN101PAEN-RC; Package: 0; Lead Free: Yes; Device Class L3: unset; Octopart: https://octopart.com/nrpn101paen-rc-sullins-18674398; Device Class L1: Connectors; Contact Material: Gold,Nickel; ComponentLink2URL: https://s3.amazonaws.com/catalogspreads-pdf/PAGE104-105%202mm%20MALE%20HDR%20ST%20RA%20SMT.pdf; Footprint Url: https://drawings-pdf.s3.amazonaws.com/10531.pdf; Height: 5.95mm; Digikey Description: CONN HEADER VERT 10POS 2MM; Category: Conn; Automotive: No; Number Of Rows: 1; Device Class L2: Headers and Wire Housings; Temperature Range High: +105°C; Temperature Range Low: -40°C; Pitch: 2mm; RoHS: TRUE; ComponentLink2Description: Datasheet
R1-R8 = CMP-2000-00858-1: Manufacturer: Panasonic; Part Number: ERJ-3RQFR56V